# Altium schematic sheet CurrentSenseLowSide.SchDoc: Low-Side Phase Current Sense
size A; DrawnBy: Brent; DocumentNumber: XXXXXX; Revision: A; SheetNumber: 4; SheetTotal: 8
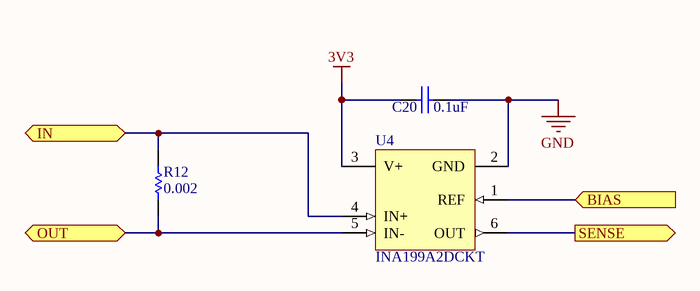
[diagram p0: CurrentSenseLowSide.SchDoc]

## Parts
C20  0.1uF  [CAPC0603(1608)100_L]
R12  0.002  [0805-SHUNT]
U4  INA199A2DCKT  [DCK0006A_L]

## Ports
BIAS (in), IN, OUT, SENSE (out)

## Nets
3V3: C20.1 U4.3(V+)
GND: C20.2 U4.2(GND)
BIAS: U4.1(REF) ; port BIAS
IN: R12.2 U4.4(IN+) ; port IN
OUT: R12.1 U4.5(IN-) ; port OUT
SENSE: U4.6(OUT) ; port SENSE

## Library data of the parts
C20 = CMP-1035-02595-1: CAP 100nF 100V ±10% 0603 (1608 Metric) Thickness 1mm SMD; Tolerance: Â±10%; Case-EIA: 0603; Case-Metric: 1608; Rated Voltage: 100 V; Value: 100nF; Technology: SMT; Max Thickness: 1 mm
R12 = PMR10EZPFV2L00
U4 = CMP-0704-00045-2: Voltage Output, High or Low Side Measurement, Bi-Directional Zero-Drift Series, 2.7 to 26 V, -40 to 125 degC, 6-pin SOT23 (DCK6), Green (RoHS & no Sb/Br); Vs(Min)(V): 2.7; SubFamily: Current Shunt Monitor; Gain(V/V): 100; Quiescent Current (+/-)(Typ)(mA): 0.065; Vs(Max)(V): 26; Rating: Catalog; Input Offset (+/-)(Max)(uV): 150; Input Offset Drift (+/-)(Max)(uV/Degrees Celsius): 0.5; Small-Signal Bandwidth(Typ)(MHz): 0.03; Common Mode Range(Min)(V): -0.3; PackageReference: DCK0006A; PackageVersion: 4093553-4/G, 01/2007; Mounting Technology: Surface Mount; ComponentLink3URL: http://www.ti.com/lit/ds/symlink/ina212-q1.pdf; ComponentLink3Description: Package Specification; Common Mode Range(Max)(V): 26; Code_JEDEC: MO-203; Output Type: Voltage; CMRR(Min)(dB): 100; ComponentLink2Description: Datasheet; ComponentLink2URL: http://www.ti.com/general/docs/lit/getliterature.tsp?genericPartNumber=INA199A2&fileType=pdf; ComponentLink1Description: Manufacturer URL; ComponentLink1URL: http://www.ti.com/; Eco-Plan: Green (RoHS & no Sb/Br); PackageDescription: 6-Pin Plastic Small Outline, Body 2 x 1.25 mm, Pitch 0.65 mm; DatasheetVersion: SBOS469D; PartNumber: INA199A2DCKT